# Altium schematic sheet norbi_lm_pl_single_power_ch.SchDoc: Имя
size 209 x 297 mm; ApprovedBy: Утвердил; CheckedBy: Проверил; Author: Разработал; Organization: НГУ; DocumentNumber: Децимальный номер Э3; SheetNumber: Лист; SheetTotal: Листов; PageSetup: Record=PageOptions|CenterHorizontal=True|CenterVertical=True|PrintScale=1.00|XCorrection=1.00|YCorrection=1.00|PrintKind=1|BorderSize=5000000|LeftOffset=0|BottomOffset=0|Orientation=2|PaperLength=1000|PaperWidth=1000|Scale=100|PaperSource=15|PrintQuality=1200|MediaType=1|DitherType=10|PaperKind=A3|PrintScaleMode=1; Weight: -; ScaleFactor: -; NormInspection: Норм.Контр.
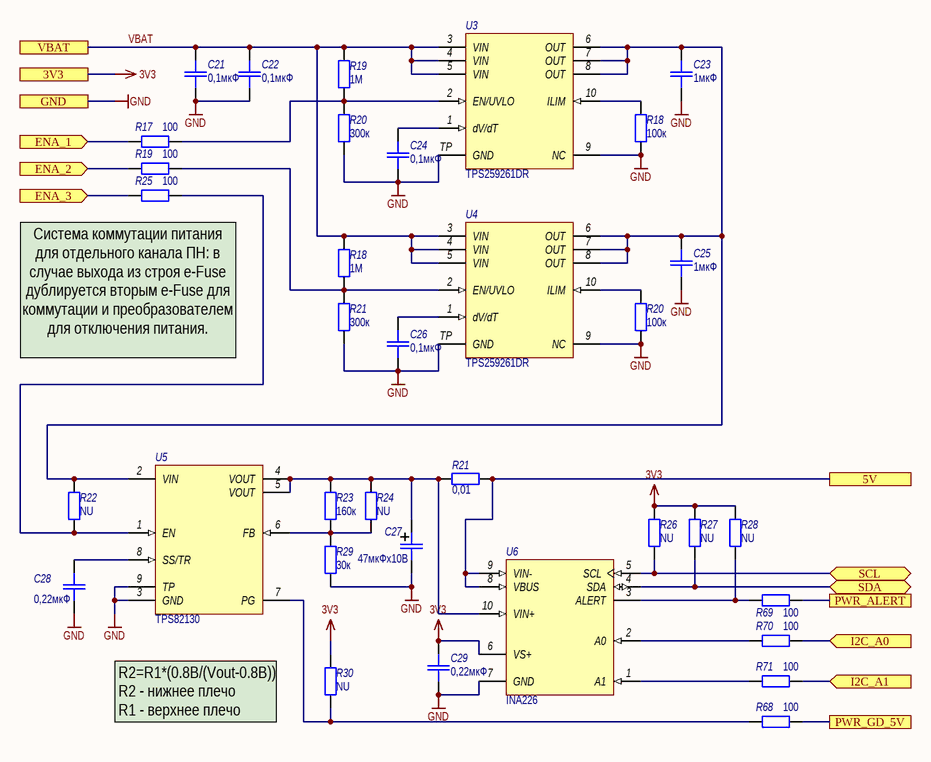
[diagram p0: norbi_lm_pl_single_power_ch.SchDoc]

## Parts
(Parts that share a designator on the sheet are numbered #1, #2 ... from top to bottom, then left to right.)
C21  0,1мкФ  [CR-0603]
C22  0,1мкФ  [CR-0603]
C23  1мкФ  [CR-0603]
C24  0,1мкФ  [CR-0603]
C25  1мкФ  [CR-0603]
C26  0,1мкФ  [CR-0603]
C27  47мкФх10В  [C_SMD_SIZE_B]
C28  0,22мкФ  [CR-0603]
C29  0,22мкФ  [CR-0603]
R17  100  [CR-0603]
R18#1  100к  [CR-0603]
R18#2  1M  [CR-0603]
R19#1  1M  [CR-0603]
R19#2  100  [CR-0603]
R20#1  300к  [CR-0603]
R20#2  100к  [CR-0603]
R21#1  300к  [CR-0603]
R21#2  0,01  [CR-1206]
R22  NU  [CR-0603]
R23  160к  [CR-0603]
R24  NU  [CR-0603]
R25  100  [CR-0603]
R26  NU  [CR-0603]
R27  NU  [CR-0603]
R28  NU  [CR-0603]
R29  30к  [CR-0603]
R30  NU  [CR-0603]
R68  100  [CR-0603]
R69  100  [CR-0603]
R70  100  [CR-0603]
R71  100  [CR-0603]
U3  Наименование: TPS259261DR  [VSON-10]  (hidden comment: TPS259261ВК)
U4  Наименование: TPS259261DR  [VSON-10]  (hidden comment: TPS259261ВК)
U5  TPS82130  [uSiL-8]
U6  INA261  [VSSOP-8]  (value not drawn)

## Ports
3V3, 5V, ENA_1 (in), ENA_2 (in), ENA_3 (in), GND, I2C_A0 (in), I2C_A1 (in), PWR_ALERT, PWR_GD_5V, SCL (bidir), SDA (bidir), VBAT

## Nets
3V3: C29.2 R26.2 R27.2 R28.2 R30.2 U6.6(VS+) ; port 3V3
GND: C21.1 C22.1 C23.1 C24.1 C25.1 C26.1 C27.2 C28.1 C29.1 R18#1.1 R20#1.2 R20#2.1 R21#1.2 R29.1 U3.9(NC) U3.TP(GND) U4.9(NC) U4.TP(GND) U5.3(GND) U5.9(TP) U6.7(GND) ; port GND
5V: R21#2.1 U6.8(VBUS) U6.9(VIN-) ; port 5V
ENA_1: R17.2 ; port ENA_1
ENA_2: R19#2.2 ; port ENA_2
ENA_3: R25.2 ; port ENA_3
I2C_A0: R70.1 ; port I2C_A0
I2C_A1: R71.1 ; port I2C_A1
PWR_ALERT: R69.1 ; port PWR_ALERT
PWR_GD_5V: R68.1 ; port PWR_GD_5V
SCL: R26.1 U6.5(SCL) ; port SCL
SDA: R27.1 U6.4(SDA) ; port SDA
VBAT: C21.2 C22.2 R18#2.1 R19#1.1 U3.3(VIN) U3.4(VIN) U3.5(VIN) U4.3(VIN) U4.4(VIN) U4.5(VIN) ; port VBAT
NetC23_2: C23.2 C25.2 R22.2 U3.6(OUT) U3.7(OUT) U3.8(OUT) U4.6(OUT) U4.7(OUT) U4.8(OUT) U5.2(VIN)
NetC24_2: C24.2 U3.1(dV/dT)
NetC26_2: C26.2 U4.1(dV/dT)
NetC27_1: C27.1 R21#2.2 R23.2 R24.2 U5.4(VOUT) U5.5(VOUT) U6.10(VIN+)
NetC28_2: C28.2 U5.8(SS/TR)
NetR17_1: R17.1 R19#1.2 R20#1.1 U3.2(EN/UVLO)
NetR18#1_2: R18#1.2 U3.10(ILIM)
NetR18#2_2: R18#2.2 R19#2.1 R21#1.1 U4.2(EN/UVLO)
NetR20#2_2: R20#2.2 U4.10(ILIM)
NetR22_1: R22.1 R25.1 U5.1(EN)
NetR23_1: R23.1 R24.1 R29.2 U5.6(FB)
NetR28_1: R28.1 R69.2 U6.3(ALERT)
NetR30_1: R30.1 R68.2 U5.7(PG)
NetR70_2: R70.2 U6.2(A0)
NetR71_2: R71.2 U6.1(A1)

## Notes on the sheet
- (near R25) Система коммутации питания для отдельного канала ПН: в случае выхода из строя e-Fuse дублируется вторым e-Fuse для коммутации и преобразователем для отключения питания.
- R2=R1*(0.8В/(Vout-0.8B))
  R2 - нижнее плечо
  R1 - верхнее плечо
- Подп. и дата
- Инв. № дубл.
- Взам. инв. №
- Инв. № подл.
- Изм.
- Лист
- № докум.
- Подп.
- Дата
- Форма 2а ГОСТ 2.104-2006
- Копировал
- Формат А4

## Library data of the parts
C21-C26 C28 C29 = C_smd: Конденсатор для поверхностного монтажа; Назначение: Чип-конденсатор; Наименование: К10-79 МП0 «ВП»; Потребление, Вт: 0
  C21 C22 C24 C26: Value: 0,1мкФ
  C23 C25: Value: 1мкФ
  C28 C29: Value: 0,22мкФ
C27 = C_pol_smd: Поляризованный конеднсатор для поверхностного монтажа; Назначение: Поляризованный чип-конденсатор; Наименование: К53-68 «ВП»; Потребление, Вт: 0; Value: 47мкФх10В
R17 R18#1 R18#2 R19#1 R19#2 R20#1 R20#2 R21#1 R25 R68-R71 = R_smd: Резистор для поверхностного монтажа; Наименование: Р1-12-0.125 ОСМ; Назначение: Чип-резистор; Потребление, Вт: 0,001
  R17 R19#2 R25 R68-R71: Value: 100
  R18#1 R20#2: Value: 100к
  R18#2 R19#1: Value: 1M
  R20#1 R21#1: Value: 300к
R21#2 = R_smd: Резистор для поверхностного монтажа; Назначение: Чип-резистор токоизмерительный; Наименование: WSL1206R0100FEA; Потребление, Вт: 0,001; Value: 0,01
R22-R24 R26-R30 = R_smd: Резистор для поверхностного монтажа; Назначение: Чип-резистор; Наименование: Р1-12-0.125 ОСМ; Потребление, Вт: 0,001
  R22 R24 R26-R28 R30: Value: NU
  R23: Value: 160к
  R29: Value: 30к
U3 U4 = TPS259261: Simple 5-V/12-V eFuse Protection Switches; Потребление, Вт: 0,001; Назначение: Simple 5-V/12-V eFuse Protection Switches; ComponentLink1Description: Datasheet; ComponentLink1URL: http://www.ti.com/lit/ds/symlink/tps25925.pdf
U5 = TPS82130: 17-V Input 3-A Step-Down Converter MicroSiP™ Module with Integrated Inductor; Потребление, Вт: 1,0; ComponentLink1Description: Data sheet; ComponentLink1URL: http://www.ti.com/lit/ds/symlink/tps82130.pdf; Назначение: 17-V Input 3-A Step-Down Converter MicroSiP™ Module with Integrated Inductor; Наименование: TPS82130
U6 = INA226: High- or Low-Side Measurement, Bidirectional Current and Power Monitor With I2C Interface; Назначение: High-Side or Low-Side Measurement,; Потребление, Вт: 0,001; ComponentLink1Description: Data sheet; ComponentLink1URL: http://www.ti.com/lit/ds/symlink/ina226.pdf; Наименование: INA226